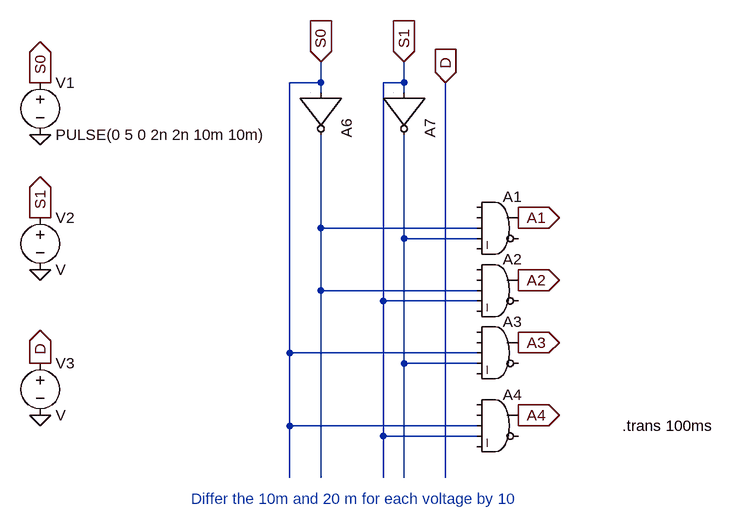
[diagram p0: schematic 4X1_DeMUX.asc]
4X1_DeMUX.asc, the LTspice schematic file:
Version 4
SHEET 1 880 680
WIRE -32 -144 -32 -176
WIRE -32 -144 -80 -144
WIRE 96 -144 96 -176
WIRE 96 -144 64 -144
WIRE -32 -128 -32 -144
WIRE 96 -128 96 -144
WIRE -32 80 -32 -64
WIRE 208 80 -32 80
WIRE 96 96 96 -64
WIRE 208 96 96 96
WIRE -32 176 -32 80
WIRE 208 176 -32 176
WIRE 64 192 64 -144
WIRE 208 192 64 192
WIRE -80 272 -80 -144
WIRE 208 272 -80 272
WIRE 96 288 96 96
WIRE 208 288 96 288
WIRE -80 384 -80 272
WIRE 208 384 -80 384
WIRE 64 400 64 192
WIRE 208 400 64 400
WIRE -80 464 -80 384
WIRE -32 464 -32 176
WIRE 64 464 64 400
WIRE 96 464 96 288
WIRE 160 464 160 -144
FLAG -32 -176 S0
IOPIN -32 -176 In
FLAG 96 -176 S1
IOPIN 96 -176 In
FLAG 160 -144 D
IOPIN 160 -144 In
FLAG 272 64 A1
IOPIN 272 64 Out
FLAG 272 160 A2
IOPIN 272 160 Out
FLAG 272 256 A3
IOPIN 272 256 Out
FLAG 272 368 A4
IOPIN 272 368 Out
FLAG -464 144 0
FLAG -464 368 0
FLAG -464 -64 0
FLAG -464 -144 S0
IOPIN -464 -144 Out
FLAG -464 64 S1
IOPIN -464 64 Out
FLAG -464 288 D
IOPIN -464 288 Out
SYMBOL Digital\\and 240 16 R0
SYMATTR InstName A1
SYMBOL Digital\\and 240 112 R0
SYMATTR InstName A2
SYMBOL Digital\\and 240 208 R0
SYMATTR InstName A3
SYMBOL Digital\\and 240 320 R0
SYMATTR InstName A4
SYMBOL Digital\\inv 32 -128 R90
SYMATTR InstName A6
SYMBOL Digital\\inv 160 -128 R90
SYMATTR InstName A7
SYMBOL voltage -464 -160 R0
WINDOW 123 0 0 Left 0
WINDOW 39 0 0 Left 0
SYMATTR InstName V1
SYMATTR Value PULSE(0 5 0 2n 2n 10m 10m)
SYMBOL voltage -464 48 R0
SYMATTR InstName V2
SYMBOL voltage -464 272 R0
SYMATTR InstName V3
TEXT -232 496 Left 2 ;Differ the 10m and 20 m for each voltage by 10
TEXT 432 384 Left 2 !.trans 100ms

The netlist it stands for:
* 4X1_DeMUX.asc
A1 0 0 N001 N002 0 0 A1 0 AND
A2 0 0 N001 S1 0 0 A2 0 AND
A3 0 0 S0 N002 0 0 A3 0 AND
A4 0 0 S0 S1 0 0 A4 0 AND
A6 S0 0 0 0 0 N001 0 0 BUF
A7 S1 0 0 0 0 N002 0 0 BUF
V1 S0 0 PULSE(0 5 0 2n 2n 10m 10m)
V2 S1 0 V
V3 D 0 V
* Differ the 10m and 20 m for each voltage by 10
.trans 100ms
.backanno
.end